# Altium schematic sheet Sheet1.SchDoc
size A4
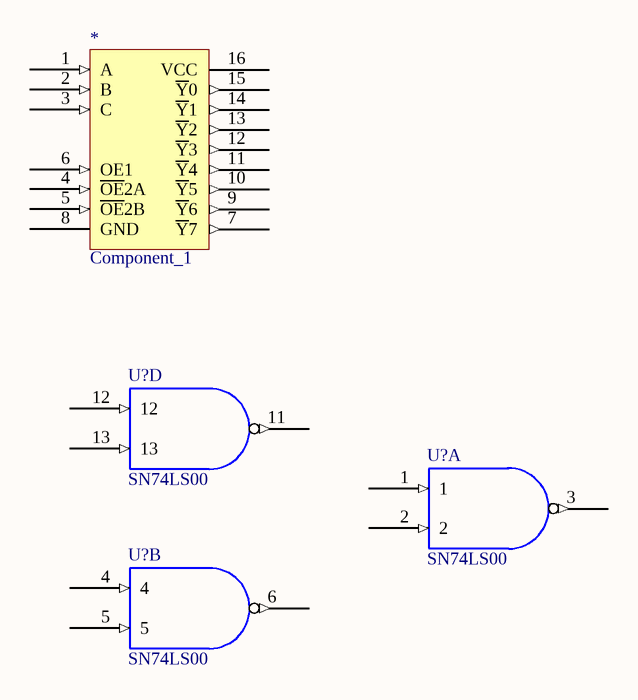
[diagram p0: Sheet1.SchDoc]

## Parts
(Parts that share a designator on the sheet are numbered #1, #2 ... from top to bottom, then left to right.)
*  Component_1
U?#1  SN74LS00  (part D of 4)
U?#2  SN74LS00  (part A of 4)
U?#3  SN74LS00  (part B of 4)

## Nets
GND: U?#1.7(GND) U?#2.7(GND) U?#3.7(GND)
VCC: U?#1.14(VCC) U?#2.14(VCC) U?#3.14(VCC)

Not connected (* = marked no-connect by the designer): * 1(A) 2(B) 3(C) 4(~{OE}2A) 5(~{OE}2B) 6(OE1) 7(~{Y}7) 8(GND) 9(~{Y}6) 10(~{Y}5) 11(~{Y}4) 12(~{Y}3) 13(~{Y}2) 14(~{Y}1) 15(~{Y}0) 16(VCC); U?#1 11 12 13; U?#2 1 2 3; U?#3 4 5 6

## Notes on the sheet
- 专升本
- 通信工程
- 李烨攀
- 2101班
- 210806300163
- 学号